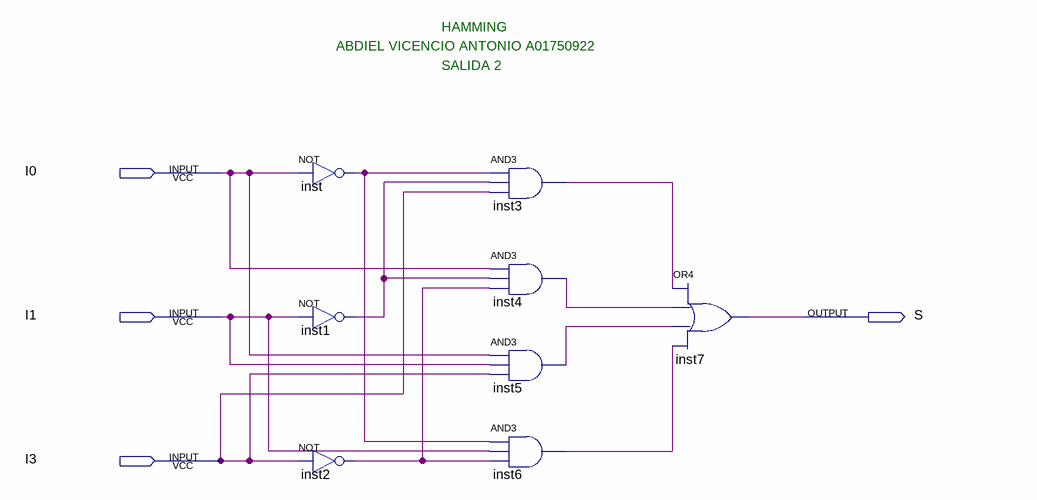
[diagram p0: schematic sheet]
// Quartus schematic Hamming.bdf as structural Verilog: 8 symbols, 4 pins
module Hamming (
  input  I0,
  input  I1,
  input  I3,
  output S
);

  wire inst1_out, inst2_out, inst3_out, inst4_out, inst5_out, inst6_out, inst_out;

  not inst (inst_out, I0);
  not inst1 (inst1_out, I1);
  not inst2 (inst2_out, I3);
  and inst3 (inst3_out, inst_out, inst1_out, I3);
  and inst4 (inst4_out, I0, inst1_out, inst2_out);
  and inst5 (inst5_out, I0, I1, I3);
  and inst6 (inst6_out, inst_out, I1, inst2_out);
  or inst7 (S, inst3_out, inst4_out, inst5_out, inst6_out);

  // Notes on the sheet:
  //   HAMMING
  //   ABDIEL VICENCIO ANTONIO A01750922
  //   SALIDA 2
endmodule
